# Altium schematic sheet LineCliffSensors.SchDoc
size A; SheetNumber: roneV11-LineCliffSensors; SheetTotal: 6
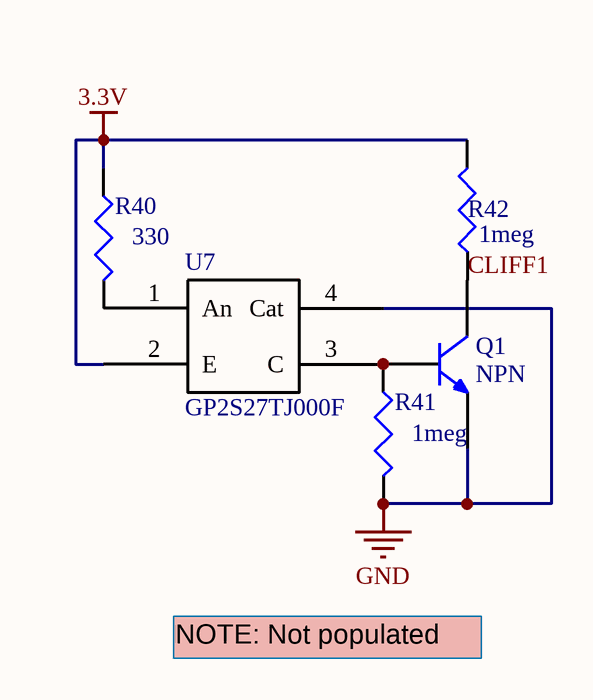
[diagram p0: LineCliffSensors.SchDoc]

## Parts
Q1  NPN  [SOT-23]
R40  value 330  [RESC1608L]  (hidden comment: Res3)
R41  value 1meg  [RESC1608L]  (hidden comment: Res3)
R42  value 1meg  [RESC1608L]  (hidden comment: Res3)
U7  GP2S27TJ000F  [GP2S27J0000F]

## Nets
3.3V: R40.1 R42.2 U7.2(E)
GND: Q1.2(E) R41.2 U7.4(Cat)
CLIFF1: Q1.3(C) R42.1
NetQ1_1: Q1.1(B) R41.1 U7.3(C)
NetR40_2: R40.2 U7.1(An)

## Notes on the sheet
- NOTE: Not populated

## Library data of the parts
R40-R42 = Res3: Resistor; Published: 8-Jun-2000; LatestRevisionDate: 29-May-2009; LatestRevisionNote: IPC-7351 Footprint Added.; PackageReference: J1-0603; Publisher: Altium Limited; PackageDescription: Chip Resistor